# EAGLE design touch-switch-controller (EAGLE 6.5.0)
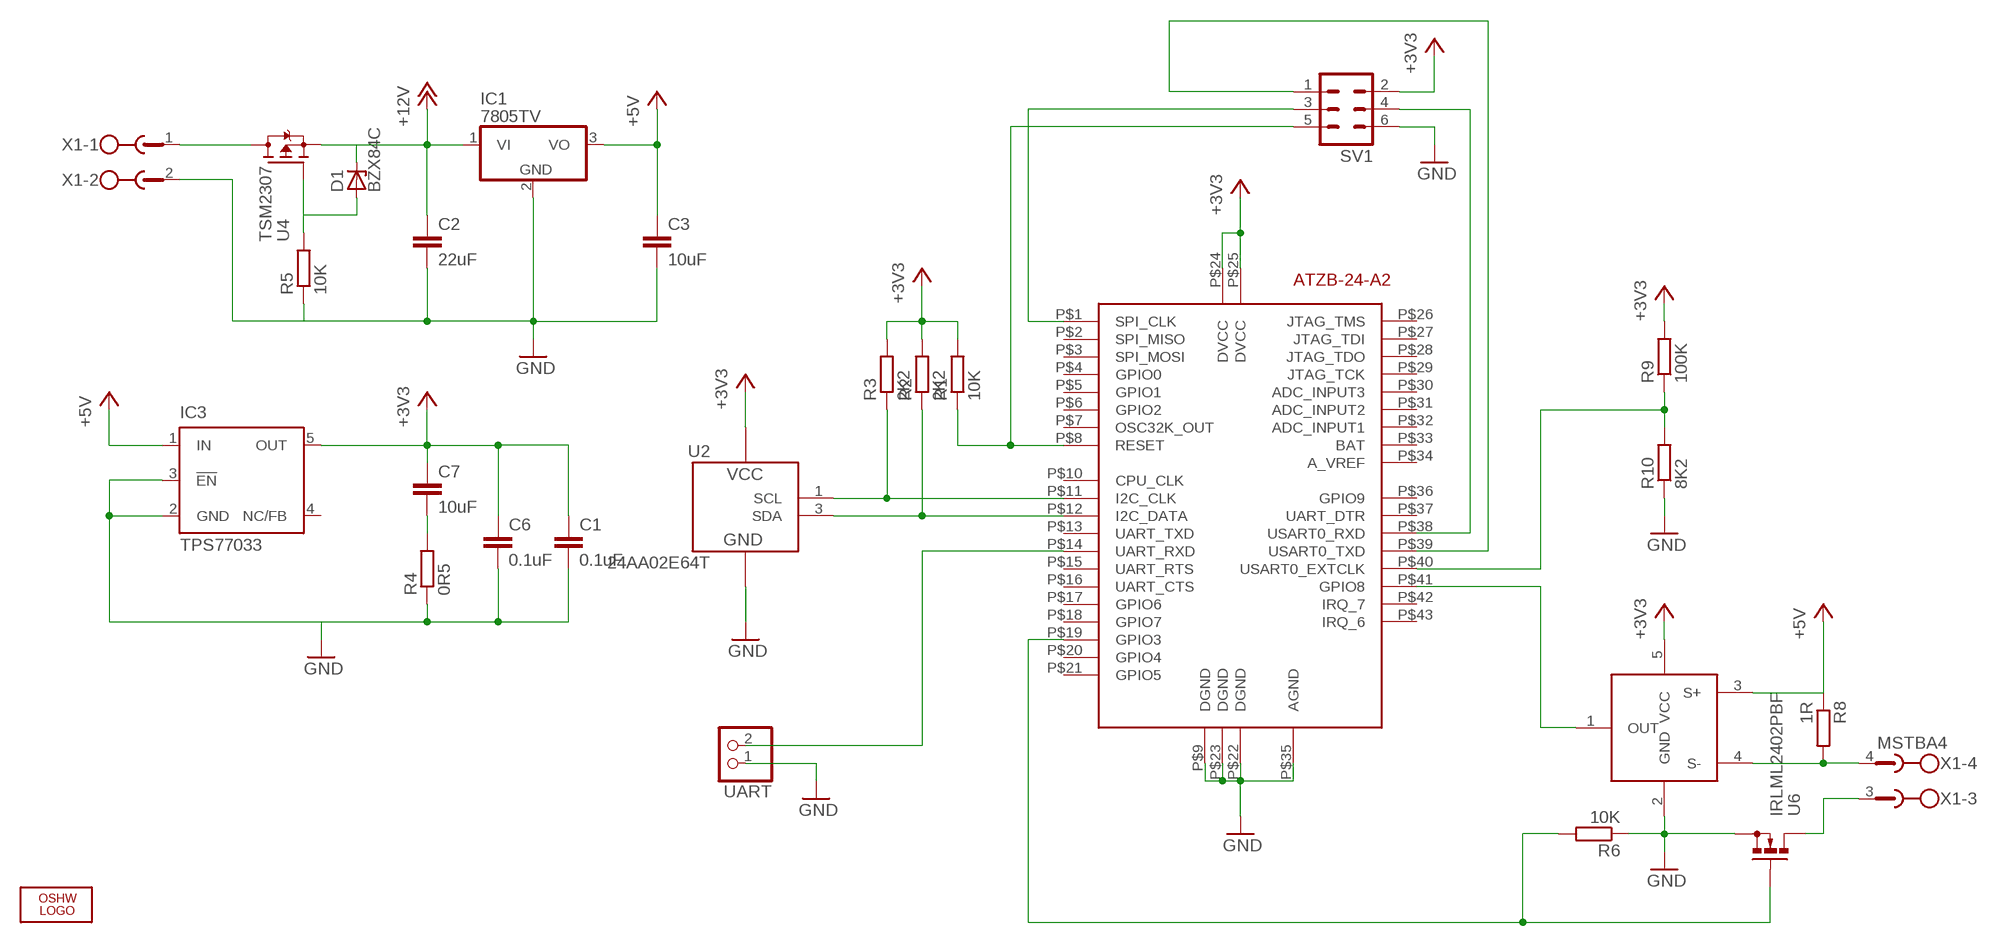
[diagram p0: schematic, sheet 1]

## Parts
C1  0.1uF  C-EUC0603  [C0603]
C2  22uF  C-EUC1210  [C1210]
C3  10uF  C-EUC1210  [C1210]
C6  0.1uF  C-EUC0603  [C0603]
C7  10uF  C-EUC1210  [C1210]
D1  BZX84C  [SOT23]
IC1  7805TV  [TO220V]
IC3  TPS77033  [SOT23-DBV]
LOGO1  OSHW_LOGO_FILLX0100-NT  [OSHW_FILLX100_NOTEXT]
R1  10K  R-EU_R0603  [R0603]
R2  2K2  R-EU_R0603  [R0603]
R3  2K2  R-EU_R0603  [R0603]
R4  0R5  R-EU_R0603  [R0603]
R5  10K  R-EU_R0603  [R0603]
R6  10K  R-EU_R0603  [R0603]
R8  1R  R-EU_R0603  [R0603]
R9  100K  R-EU_R0603  [R0603]
R10  8K2  R-EU_R0603  [R0603]
SV1  MA03-2  [MA03-2]
U1  ZXCT1086  [SOT23-5L]
U2  24AA02E64T  [SOT23-5L]
U4  TSM2307  [SOT23]
U6  IRLML2402PBF  MMBF170  [SOT23]
U$3  ATZB-24-A2  [ATZB-24-A2]
UART  PINHD-1X2  [1X02]
X1  MSTBA4  [MSTBA4]

## Nets
+3V3: C1.1 C6.1 C7.1 IC3.5(OUT) R1.2 R2.2 R3.2 R9.2 SV1.2 U1.5(VCC) U2.4(VCC) U$3.P$24(DVCC) U$3.P$25(DVCC)
+5V: C3.1 IC1.3(VO) IC3.1(IN) R8.1 U1.3(S+)
+12V: C2.1 D1.3(C) IC1.1(VI) U4.2(S)
GND: C1.2 C2.2 C3.2 C6.2 IC1.2(GND) IC3.2(GND) IC3.3(!EN) R4.1 R5.1 R6.1 R10.1 SV1.6 U1.2(GND) U2.2(VSS) U6.2(S) U$3.P$9(DGND) U$3.P$22(DGND) U$3.P$23(DGND) U$3.P$35(AGND) UART.1 X1.2
N$1: R9.1 R10.2 U$3.P$40(USART0_EXTCLK)
N$2: U1.1(OUT) U$3.P$41(GPIO8)
N$3: R6.2 U6.1(G) U$3.P$19(GPIO3)
N$4: U4.3(D) X1.1
N$5: SV1.1 U$3.P$39(USART0_TXD)
N$6: SV1.4 U$3.P$38(USART0_RXD)
N$7: R3.1 U2.1(SCL) U$3.P$11(I2C_CLK)
N$8: SV1.3 U$3.P$1(SPI_CLK)
N$9: R1.1 SV1.5 U$3.P$8(RESET)
N$10: R2.1 U2.3(SDA) U$3.P$12(I2C_DATA)
N$11: C7.2 R4.2
N$12: D1.1(A) R5.2 U4.1(G)
N$13: U$3.P$14(UART_RXD) UART.2
N$14: U6.3(D) X1.3
N$29: R8.2 U1.4(S-) X1.4
Unconnected: IC3.4(NC/FB) U$3.P$2(SPI_MISO) U$3.P$3(SPI_MOSI) U$3.P$4(GPIO0) U$3.P$5(GPIO1) U$3.P$6(GPIO2) U$3.P$7(OSC32K_OUT) U$3.P$10(CPU_CLK) U$3.P$13(UART_TXD) U$3.P$15(UART_RTS) U$3.P$16(UART_CTS) U$3.P$17(GPIO6) U$3.P$18(GPIO7) U$3.P$20(GPIO4) U$3.P$21(GPIO5) U$3.P$26(JTAG_TMS) U$3.P$27(JTAG_TDI) U$3.P$28(JTAG_TDO) U$3.P$29(JTAG_TCK) U$3.P$30(ADC_INPUT3) U$3.P$31(ADC_INPUT2) U$3.P$32(ADC_INPUT1) U$3.P$33(BAT) U$3.P$34(A_VREF) U$3.P$36(GPIO9) U$3.P$37(UART_DTR) U$3.P$42(IRQ_7) U$3.P$43(IRQ_6)

## Library data of the parts
C1-C3 C6 C7 = resistor:C-EU: CAPACITOR, European symbol
D1 = __SR:BZX84C: Z DIODE
IC1 = linear:78*: Positive VOLTAGE REGULATOR Source: http://cache.national.com/ds/LM/LM78L05.pdf http://www.fairchildsemi.com/ds/LM/LM7805.pdf
IC3 = texas:TPS770*: ULTRALOW-POWER 50-mA LOW-DROPOUT LINEAR REGULATORS 50-mA Low-Dropout Regulator Source: http://focus.ti.com/lit/ds/symlink/tps77001.pdf; MF: TEXAS INSTRUMENTS; MPN: TPS77033DBVT; OC_FARNELL: 8461570; OC_NEWARK: 77C1187
LOGO1 = ohw-logo:OSHW_LOGO_FILL
R1-R6 R8-R10 = resistor:R-EU_: RESISTOR, European symbol
SV1 = con-lstb:MA03-2: PIN HEADER; OC_FARNELL: unknown; OC_NEWARK: unknown
U1 = __SR:ZXCT1086
U2 = __SR:24AA02E64T
U4 = __SR:TSM2307
U6 = __SR:MMBF170
U$3 = __SR:ATZB-24-A2
UART = pinhead:PINHD-1X2: PIN HEADER
X1 = con-phoenix-508:MSTBA4: PHOENIX; MF: FARNELL; MPN: 1757268; OC_FARNELL: 3705195; OC_NEWARK: 71C4163

## Board
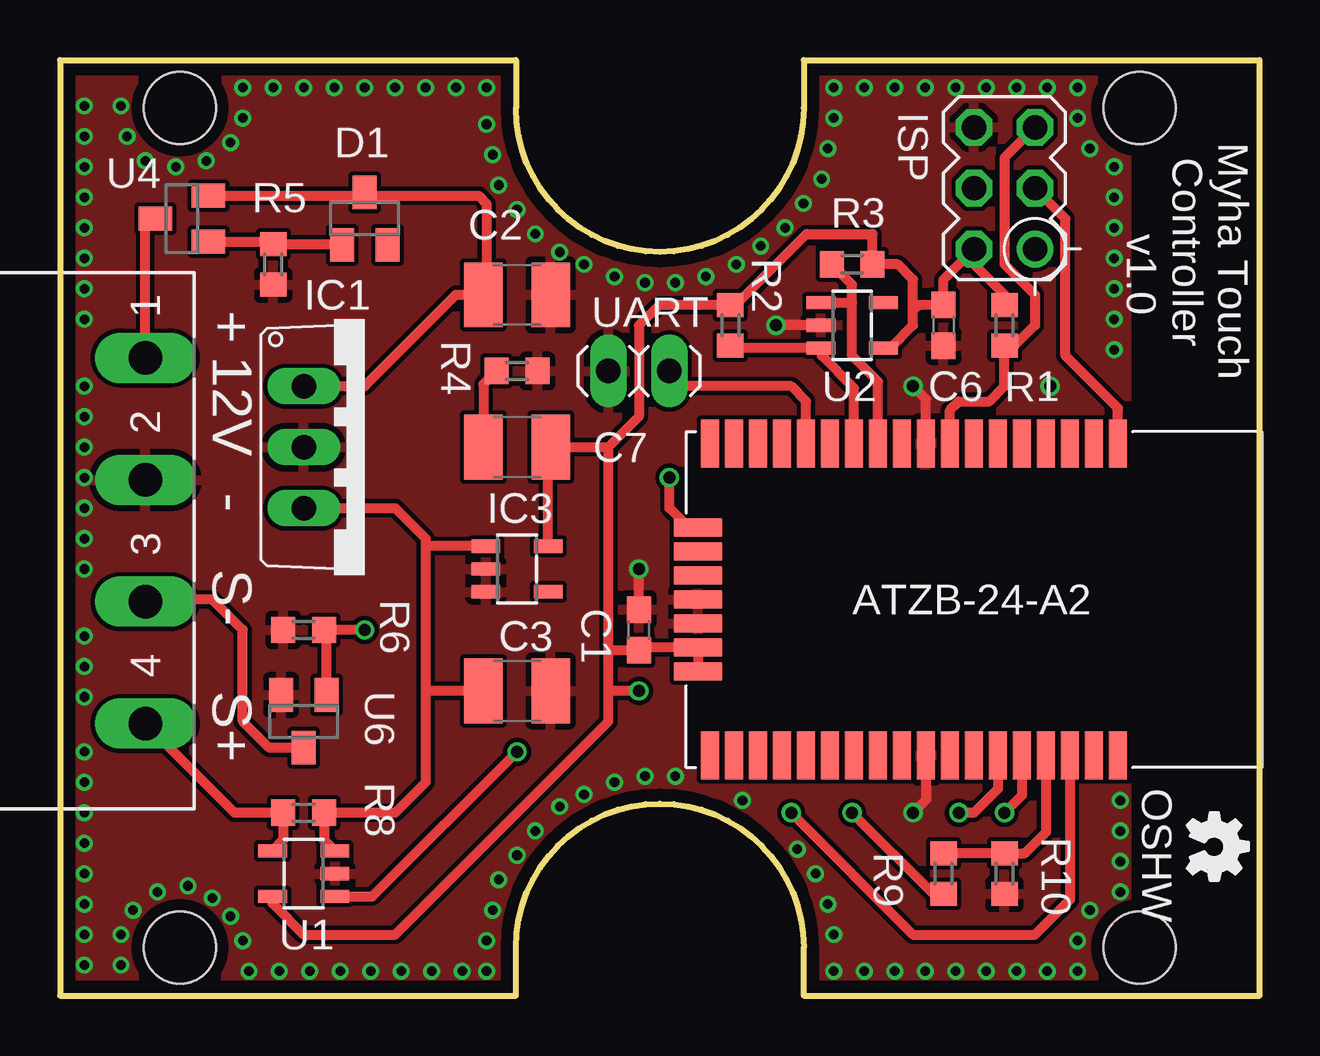
[diagram p1: board, top side]
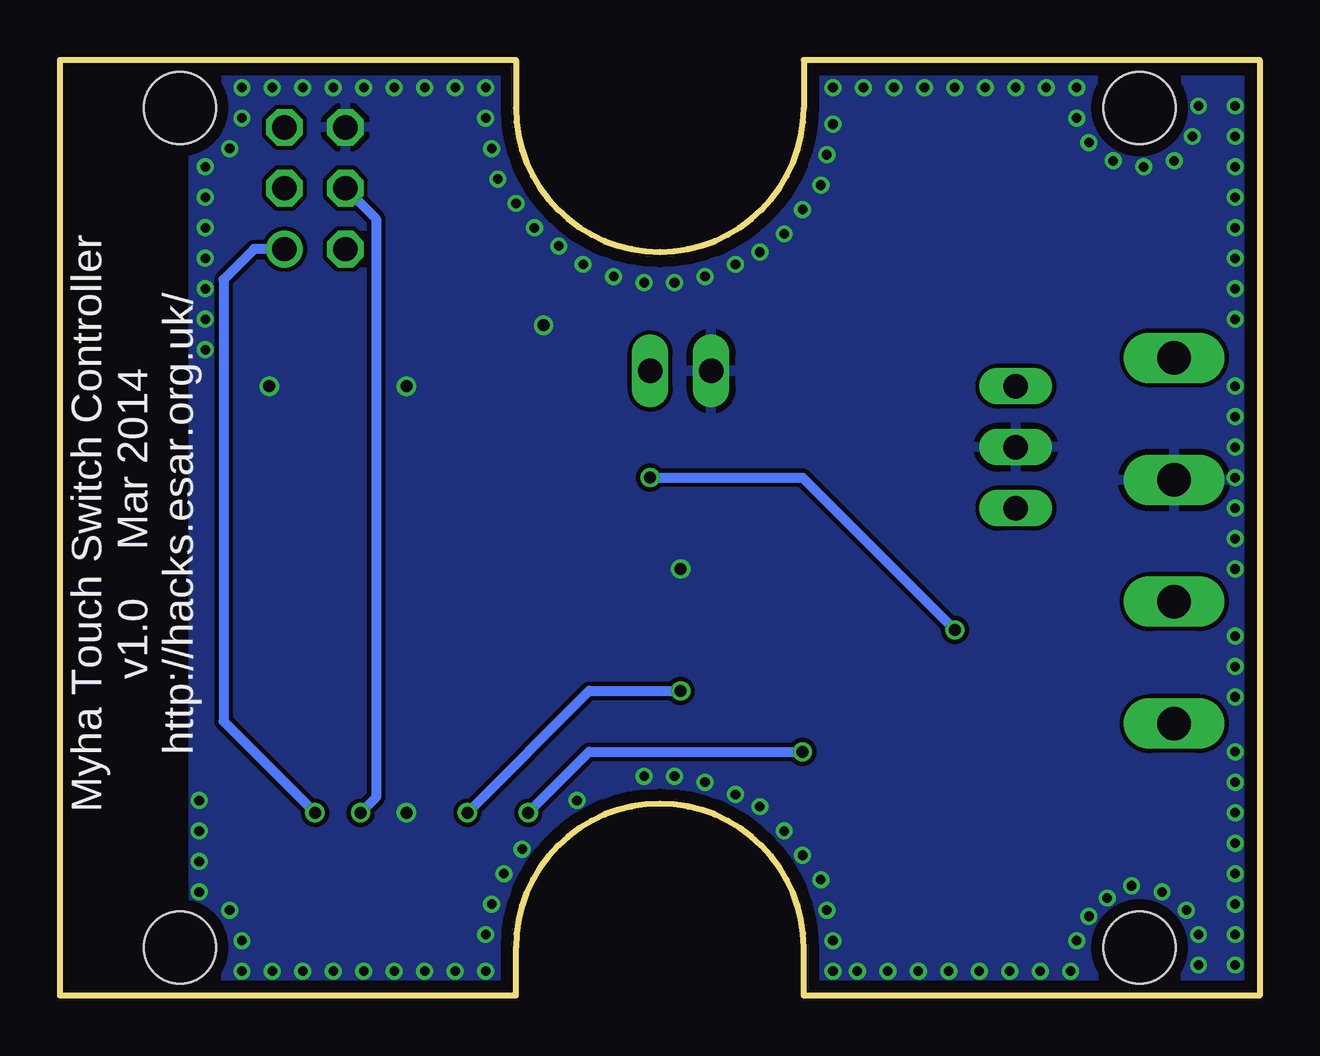
[diagram p2: board, bottom side, seen from below]

Size 50 x 39 mm. Coordinates in mm from the lower left corner, seen from the top.
Outline: 31,0 50,0 50,39 31,39 31,37 arc-180 19,37 19,39 0,39 0,0 19,0 19,2 arc-180 31,2 31,0
Copper layers (1*16): Top 0.035mm / dielectric 1.5mm / Bottom 0.035mm
Design rules "EagleRules *": minimum track width 7mil, minimum drill 12mil, track to track 7mil, track to pad 7mil, pad to pad 7mil, via to via 7mil, smd to smd 0mil, copper to edge 20mil, drill to drill 10mil, minimum pad ring 10mil, minimum via ring 6mil, stop-mask expansion 2mil, vias tented up to drill 25mil, thermal gap 10mil
Holes 3 mm at 5,2 45,2 5,37 45,37

### Footprints (pad centres in the part's own frame; a part is rotated, then mirrored left to right if it is on the bottom)
C0603 = smd 1.1 x 1: 1 -0.85,0; 2 0.85,0
C1210 = smd 1.6 x 2.7: 1 -1.4,0; 2 1.4,0
SOT23 = smd 1 x 1.4: 1 -0.95,-1.1; 2 0.95,-1.1; 3 0,1.1
TO220V = drill 1.016 long: 1 -2.54,-2.54; 2 0,-2.54; 3 2.54,-2.54
SOT23-DBV = smd 0.55 x 1.2: 1 -0.95,-1.3; 2 0,-1.3; 3 0.95,-1.3; 4 0.95,1.3; 5 -0.95,1.3
R0603 = smd 1 x 1.1: 1 -0.85,0; 2 0.85,0
MA03-2 = drill 1.016: 1 -2.54,-1.27 | drill 1.016 octagon: 2 -2.54,1.27; 3 0,-1.27; 4 0,1.27; 5 2.54,-1.27; 6 2.54,1.27
SOT23-5L = smd 0.55 x 1.2: 1 -0.95,-1.3; 2 0,-1.3; 3 0.95,-1.3; 4 0.95,1.3; 5 -0.95,1.3
ATZB-24-A2 = smd 0.75 x 2: P$1 6,6.5; P$2 5,6.5; P$3 4,6.5; P$4 3,6.5; P$5 2,6.5; P$6 1,6.5; P$7 0,6.5; P$8 -1,6.5; P$9 -2,6.5; P$10 -3,6.5; P$11 -4,6.5; P$12 -5,6.5; P$13 -6,6.5; P$14 -7,6.5; P$15 -8,6.5; P$16 -9,6.5; P$17 -10,6.5; P$18 -11,6.5; P$26 -11,-6.5; P$27 -10,-6.5; P$28 -9,-6.5; P$29 -8,-6.5; P$30 -7,-6.5; P$31 -6,-6.5; P$32 -5,-6.5; P$33 -4,-6.5; P$34 -3,-6.5; P$35 -2,-6.5; P$36 -1,-6.5; P$37 0,-6.5; P$38 1,-6.5; P$39 2,-6.5; P$40 3,-6.5; P$41 4,-6.5; P$42 5,-6.5; P$43 6,-6.5 | smd 2 x 0.75: P$19 -11.5,3; P$20 -11.5,2; P$21 -11.5,1; P$22 -11.5,0; P$23 -11.5,-1; P$24 -11.5,-2; P$25 -11.5,-3
1X02 = drill 1.016 long: 1 -1.27,0; 2 1.27,0
MSTBA4 = drill 1.397 long: 1 -7.62,5.08; 2 -2.54,5.08; 3 2.54,5.08; 4 7.62,5.08

### Placement (x,y rotation side)
C1  24.13,15.24 90 top
C2  19.05,29.21 0 top
C3  19.05,12.7 0 top
C6  36.83,27.94 270 top
C7  19.05,22.86 180 top
D1  12.7,32.38 0 top
IC1  12.7,22.86 270 top
IC3  19.05,17.78 270 top
LOGO1  46.99,7.62 270 top
R1  39.37,27.94 90 top
R2  27.94,27.94 90 top
R3  33.02,30.48 0 top
R4  19.05,26.04 180 top
R5  8.89,30.48 90 top
R6  10.16,15.24 0 top
R8  10.16,7.62 180 top
R9  36.83,5.08 270 top
R10  39.37,5.08 90 top
SV1  39.37,33.66 90 top
U1  10.16,5.08 90 top
U2  33.02,27.94 270 top
U4  5.08,32.38 90 top
U6  10.16,11.43 180 top
U$3  38.1,16.51 0 top
UART  24.13,26.04 0 top
X1  -1.52,18.96 270 top

### Tracks (layer width: path | path; a pad name or v marks a point on that pad's centre or on a via)
+3V3  (via drill 0.5)
  Top 0.406: U$3.P$25 U$3.P$24 24.25,14.51 C1.1 22.86,14.39 | IC3.5 20.35,22.76 C7.1 22.86,22.86 | U1.5 8.86,3.84 10.16,2.54 13.97,2.54 22.86,11.43 22.86,12.7 | 22.86,12.7 22.86,14.39 | R9.2 36.41,4.23 v33.02,7.62 | v24.13,12.7 22.86,12.7 | C6.1 36.62,28.79 | R1.2 39.37,29.21 38.1,30.48 SV1.2 36.83,29.84 C6.1 | U2.4 34.61,26.99 35.56,27.94 35.56,28.57 | 35.56,28.57 35.56,29.84 34.92,30.48 R3.2 33.87,31.75 31.11,31.75 28.16,28.79 R2.2 24.98,28.79 24.13,27.94 24.13,24.13 22.86,22.86 | C6.1 35.77,28.79 35.56,28.57 | 22.86,14.39 22.86,22.86
  Bottom 0.406: v33.02,7.62 27.94,12.7 v24.13,12.7
+5V
  Top 0.406: IC1.3 13.97,20.32 15.24,19.05 15.24,18.73 | 15.24,18.73 15.24,12.7 | 15.24,12.7 15.24,8.89 13.97,7.62 R8.1 11.01,6.48 U1.3 | C3.1 15.24,12.7 | IC3.1 15.24,18.73
+12V
  Top 0.406: U4.2 12.55,33.34 | 12.55,33.34 D1.3 | 12.55,33.34 17.46,33.34 17.78,33.02 17.78,29.34 C2.1 16.51,29.21 12.7,25.4 IC1.1
GND  (via drill 0.4, 0.5)
  Top 0.406: U2.2 v29.84,27.94 | U$3.P$9 36.1,24.86 v35.56,25.4 | C1.2 v24.13,17.78 | U$3.P$35 36.1,8.16 v35.56,7.62
  other vias: 41.27,25.4 21.84,30.48 23.11,29.97 24.38,29.72 25.65,29.72 26.92,29.97 28.19,30.48 29.21,31.24 30.23,32 30.99,33.02 31.75,34.04 32,35.31 32.26,36.58 32.26,37.85 33.53,37.85 34.8,37.85 36.07,37.85 37.34,37.85 38.61,37.85 39.88,37.85 41.15,37.85 42.42,37.85 42.42,36.58 42.93,35.31 43.94,34.54 43.94,33.27 43.94,32 43.94,30.73 43.94,29.46 43.94,28.19 43.94,26.92 20.83,30.99 19.81,31.75 19.05,32.77 18.29,33.78 18.03,35.05 17.78,36.32 17.78,37.85 16.51,37.85 15.24,37.85 13.97,37.85 12.7,37.85 11.43,37.85 10.16,37.85 8.89,37.85 7.62,37.85 7.62,36.58 7.11,35.56 6.1,34.8 4.83,34.54 3.56,34.8 2.79,35.81 2.54,37.08 1.02,37.08 1.02,35.81 1.02,34.54 1.02,33.27 1.02,32 1.02,30.73 1.02,29.46 1.02,28.19 1.02,25.4 1.02,24.13 1.02,22.86 1.02,21.59 1.02,20.32 1.02,19.05 1.02,17.78 1.02,14.99 1.02,13.72 1.02,12.45 1.02,10.16 1.02,8.89 1.02,7.62 1.02,6.35 1.02,5.08 1.02,3.81 1.02,2.54 1.02,1.27 2.54,1.27 2.54,2.54 3.05,3.56 4.06,4.32 5.33,4.57 6.35,4.06 7.11,3.3 7.62,2.29 7.87,1.02 9.14,1.02 10.41,1.02 11.68,1.02 12.95,1.02 14.22,1.02 15.49,1.02 16.76,1.02 17.78,1.02 17.78,2.29 18.03,3.56 18.29,4.83 19.05,5.84 19.81,6.86 20.83,7.87 21.84,8.38 23.11,8.89 24.38,9.14 25.65,9.14 28.45,8.13 30.73,6.1 31.5,5.08 32,3.81 32.26,2.54 32.26,1.02 33.53,1.02 34.8,1.02 36.07,1.02 37.34,1.02 38.61,1.02 39.88,1.02 41.15,1.02 42.42,1.02 42.42,2.29 44.2,4.32 42.93,3.56 44.2,5.59 44.2,6.86 44.2,8.13
  pour Top: 0,0 0,39.37 44.45,39.37 44.45,0
  pour Bottom: 0,0 0,39.37 44.45,39.37 44.45,0
N$1
  Top 0.406: R9.1 R10.2 40.22,5.93 41.1,6.81 U$3.P$40
N$2  (via drill 0.5)
  Top 0.406: v30.48,7.62 35.56,2.54 40.64,2.54 42.1,4 U$3.P$41 | U1.1 13.02,4.13 v19.05,10.16
  Bottom 0.406: v30.48,7.62 27.94,10.16 v19.05,10.16
N$3  (via drill 0.5)
  Top 0.406: U6.1 11.11,15.14 R6.2 v12.7,15.24 | U$3.P$19 26.21,19.51 25.4,20.32 v25.4,21.59
  Bottom 0.406: v12.7,15.24 19.05,21.59 v25.4,21.59
N$4
  Top 0.406: X1.1 3.56,31.96 U4.3
N$5  (via drill 0.5)
  Top 0.406: U$3.P$39 40.1,8.35 v39.37,7.62
  Bottom 0.406: v39.37,7.62 43.18,11.43 43.18,29.84 41.91,31.11 SV1.1
N$6  (via drill 0.5)
  Top 0.406: U$3.P$38 39.1,8.62 38.1,7.62 v37.47,7.62
  Bottom 0.406: v37.47,7.62 36.83,8.26 36.83,32.38 SV1.4
N$7
  Top 0.406: 33.02,28.89 33.02,26.67 34.1,25.59 U$3.P$11 | 33.02,28.89 33.02,29.63 R3.1 | U2.1 33.02,28.89
N$8
  Top 0.406: U$3.P$1 44.1,24.48 41.91,26.67 41.91,32.38 SV1.3
N$9
  Top 0.406: SV1.5 39.37,34.92 39.37,30.48 40.64,29.21 40.64,27.94 39.79,27.09 R1.1 39.37,25.4 38.73,24.77 37.47,24.77 37.1,24.4 U$3.P$8
N$10
  Top 0.406: R2.1 27.94,26.99 U2.3 31.75,26.96 31.75,26.67 33.1,25.32 U$3.P$12
N$11
  Top 0.406: R4.2 17.65,25.48 C7.2
N$12
  Top 0.406: U4.1 8.79,31.43 R5.2 11.71,31.33 D1.1
N$13
  Top 0.406: U$3.P$14 31.1,24.78 30.48,25.4 26.04,25.4 UART.2
N$14
  Top 0.406: U6.3 8.72,10.33 7.62,11.43 7.62,15.24 6.35,16.51 3.65,16.51 X1.3
N$29
  Top 0.406: X1.4 7.28,7.62 R8.2 9.31,6.48 U1.4

### Text on the board
tPlace: + | 12V | - | S- | S+
tNames: ISP | Myha Touch | Controller | v1.0 | ATZB-24-A2 | OSHW
bNames: Myha Touch Switch Controller / v1.0 Mar 2014 / http://hacks.esar.org.uk/